# Altium schematic sheet MSP430F249.SchDoc
size A
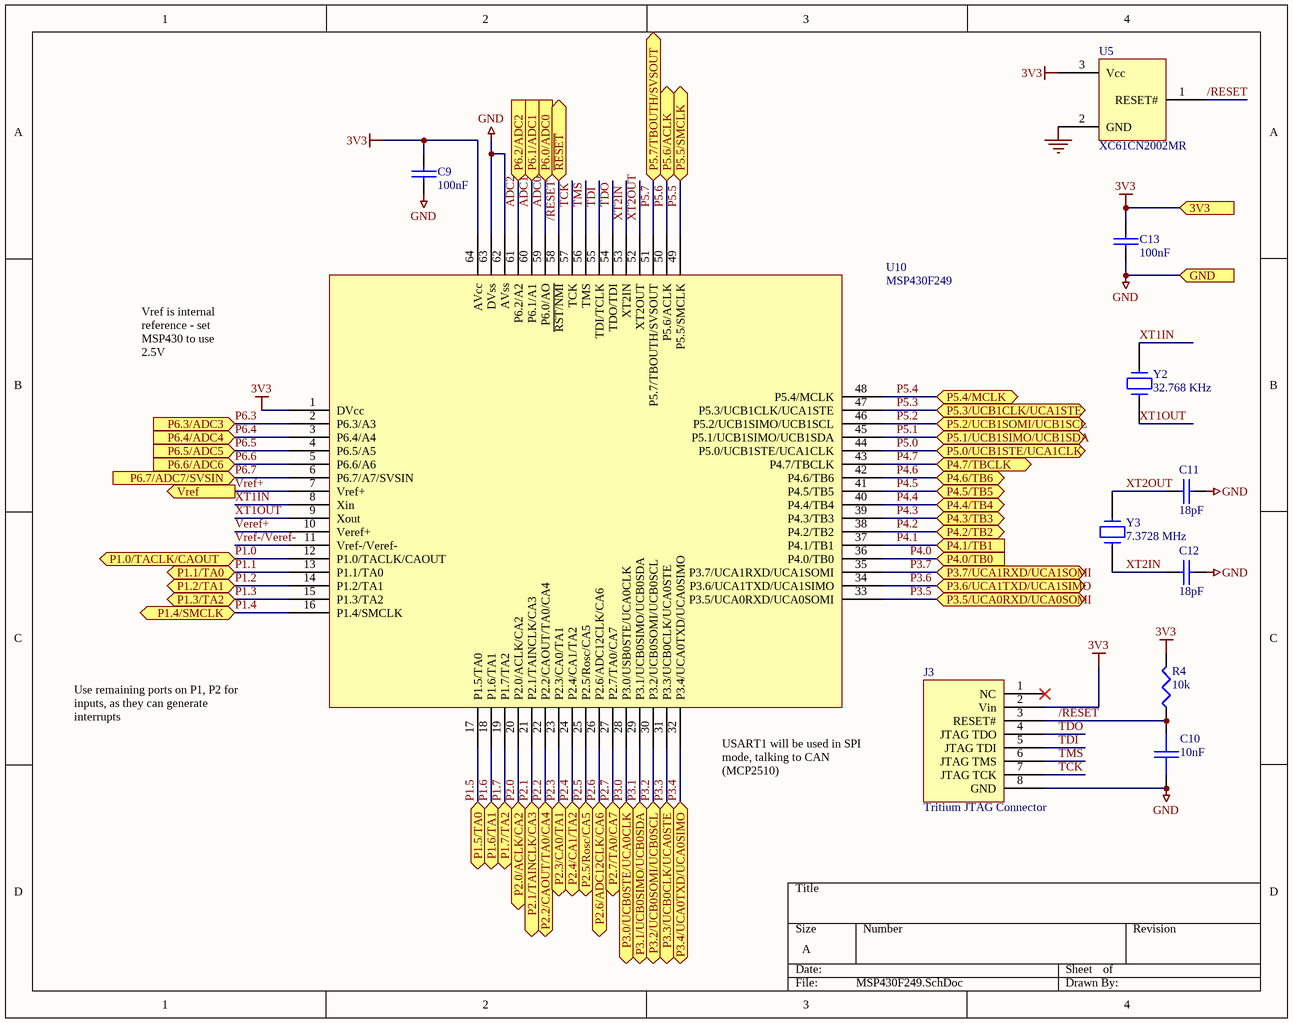
[diagram p0: MSP430F249.SchDoc]

## Parts
C9  100nF  [0603]
C10  10nF  [0603]
C11  18pF  [0603]
C12  18pF  [0603]
C13  100nF  [0603]
J3  Tritium JTAG Connector  [IDC8]
R4  10k  [0603]
U5  XC61CN2002MR  [SOT23-3]
U10  MSP430F249  [QFP64]
Y2  32.768 KHz  [WATCHA]
Y3  7.3728 MHz  [HC49/4H]

## Ports
3V3, GND, P1.0/TACLK/CAOUT, P1.1/TA0, P1.2/TA1, P1.3/TA2, P1.4/SMCLK, P1.5/TA0, P1.6/TA1, P1.7/TA2, P2.0/ACLK/CA2, P2.1/TAINCLK/CA3, P2.2/CAOUT/TA0/CA4, P2.3/CA0/TA1, P2.4/CA1/TA2, P2.5/Rosc/CA5, P2.6/ADC12CLK/CA6, P2.7/TA0/CA7, P3.0/UCB0STE/UCA0CLK, P3.1/UCB0SIMO/UCB0SDA, P3.2/UCB0SOMI/UCB0SCL, P3.3/UCB0CLK/UCA0STE, P3.4/UCA0TXD/UCA0SIMO, P3.5/UCA0RXD/UCA0SOMI, P3.6/UCA1TXD/UCA1SIMO, P3.7/UCA1RXD/UCA1SOMI, P4.0/TB0 (in), P4.1/TB1 (in), P4.2/TB2, P4.3/TB3, P4.4/TB4, P4.5/TB5, P4.6/TB6, P4.7/TBCLK, P5.0/UCB1STE/UCA1CLK, P5.1/UCB1SIMO/UCB1SDA, P5.2/UCB1SOMI/UCB1SCL, P5.3/UCB1CLK/UCA1STE, P5.4/MCLK, P5.5/SMCLK, P5.6/ACLK, P5.7/TBOUTH/SVSOUT, P6.0/ADC0 (in), P6.1/ADC1 (in), P6.2/ADC2 (in), P6.3/ADC3 (in), P6.4/ADC4 (in), P6.5/ADC5 (in), P6.6/ADC6 (in), P6.7/ADC7/SVSIN (in), Vref (out), ~{RESET}

## Nets
3V3: C9.1 C13.1 J3.2(Vin) R4.2 U5.3(Vcc) U10.1(DVcc) U10.64(AVcc) ; port 3V3
GND: C9.2 C10.2 C11.2 C12.2 C13.2 J3.8(GND) U5.2(GND) U10.62(AVss) U10.63(DVss) ; port GND
/RESET: C10.1 J3.3(RESET#) R4.1 U5.1(RESET#) U10.58(~{RST/NMI}) ; port ~{RESET}
ADC0: U10.59(P6.0/AO) ; port P6.0/ADC0
ADC1: U10.60(P6.1/A1) ; port P6.1/ADC1
ADC2: U10.61(P6.2/A2) ; port P6.2/ADC2
P1.0: U10.12(P1.0/TACLK/CAOUT) ; port P1.0/TACLK/CAOUT
P1.1: U10.13(P1.1/TA0) ; port P1.1/TA0
P1.2: U10.14(P1.2/TA1) ; port P1.2/TA1
P1.3: U10.15(P1.3/TA2) ; port P1.3/TA2
P1.4: U10.16(P1.4/SMCLK) ; port P1.4/SMCLK
P1.5: U10.17(P1.5/TA0) ; port P1.5/TA0
P1.6: U10.18(P1.6/TA1) ; port P1.6/TA1
P1.7: U10.19(P1.7/TA2) ; port P1.7/TA2
P2.0: U10.20(P2.0/ACLK/CA2) ; port P2.0/ACLK/CA2
P2.1: U10.21(P2.1/TAINCLK/CA3) ; port P2.1/TAINCLK/CA3
P2.2: U10.22(P2.2/CAOUT/TA0/CA4) ; port P2.2/CAOUT/TA0/CA4
P2.3: U10.23(P2.3/CA0/TA1) ; port P2.3/CA0/TA1
P2.4: U10.24(P2.4/CA1/TA2) ; port P2.4/CA1/TA2
P2.5: U10.25(P2.5/Rosc/CA5) ; port P2.5/Rosc/CA5
P2.6: U10.26(P2.6/ADC12CLK/CA6) ; port P2.6/ADC12CLK/CA6
P2.7: U10.27(P2.7/TA0/CA7) ; port P2.7/TA0/CA7
P3.0: U10.28(P3.0/USB0STE/UCA0CLK) ; port P3.0/UCB0STE/UCA0CLK
P3.1: U10.29(P3.1/UCB0SIMO/UCB0SDA) ; port P3.1/UCB0SIMO/UCB0SDA
P3.2: U10.30(P3.2/UCB0SOMI/UCB0SCL) ; port P3.2/UCB0SOMI/UCB0SCL
P3.3: U10.31(P3.3/UCB0CLK/UCA0STE) ; port P3.3/UCB0CLK/UCA0STE
P3.4: U10.32(P3.4/UCA0TXD/UCA0SIMO) ; port P3.4/UCA0TXD/UCA0SIMO
P3.5: U10.33(P3.5/UCA0RXD/UCA0SOMI) ; port P3.5/UCA0RXD/UCA0SOMI
P3.6: U10.34(P3.6/UCA1TXD/UCA1SIMO) ; port P3.6/UCA1TXD/UCA1SIMO
P3.7: U10.35(P3.7/UCA1RXD/UCA1SOMI) ; port P3.7/UCA1RXD/UCA1SOMI
P4.0: U10.36(P4.0/TB0) ; port P4.0/TB0
P4.1: U10.37(P4.1/TB1) ; port P4.1/TB1
P4.2: U10.38(P4.2/TB2) ; port P4.2/TB2
P4.3: U10.39(P4.3/TB3) ; port P4.3/TB3
P4.4: U10.40(P4.4/TB4) ; port P4.4/TB4
P4.5: U10.41(P4.5/TB5) ; port P4.5/TB5
P4.6: U10.42(P4.6/TB6) ; port P4.6/TB6
P4.7: U10.43(P4.7/TBCLK) ; port P4.7/TBCLK
P5.0: U10.44(P5.0/UCB1STE/UCA1CLK) ; port P5.0/UCB1STE/UCA1CLK
P5.1: U10.45(P5.1/UCB1SIMO/UCB1SDA) ; port P5.1/UCB1SIMO/UCB1SDA
P5.2: U10.46(P5.2/UCB1SIMO/UCB1SCL) ; port P5.2/UCB1SOMI/UCB1SCL
P5.3: U10.47(P5.3/UCB1CLK/UCA1STE) ; port P5.3/UCB1CLK/UCA1STE
P5.4: U10.48(P5.4/MCLK) ; port P5.4/MCLK
P5.5: U10.49(P5.5/SMCLK) ; port P5.5/SMCLK
P5.6: U10.50(P5.6/ACLK) ; port P5.6/ACLK
P5.7: U10.51(P5.7/TBOUTH/SVSOUT) ; port P5.7/TBOUTH/SVSOUT
P6.3: U10.2(P6.3/A3) ; port P6.3/ADC3
P6.4: U10.3(P6.4/A4) ; port P6.4/ADC4
P6.5: U10.4(P6.5/A5) ; port P6.5/ADC5
P6.6: U10.5(P6.6/A6) ; port P6.6/ADC6
P6.7: U10.6(P6.7/A7/SVSIN) ; port P6.7/ADC7/SVSIN
TCK: J3.7(JTAG_TCK) U10.57(TCK)
TDI: J3.5(JTAG_TDI) U10.55(TDI/TCLK)
TDO: J3.4(JTAG_TDO) U10.54(TDO/TDI)
TMS: J3.6(JTAG_TMS) U10.56(TMS)
Veref+: U10.10(Veref+)
Vref+: U10.7(Vref+) ; port Vref
Vref-/Veref-: U10.11(Vref-/Veref-)
XT1IN: U10.8(Xin) Y2.2
XT1OUT: U10.9(Xout) Y2.1
XT2IN: C12.1 U10.53(XT2IN) Y3.1
XT2OUT: C11.1 U10.52(XT2OUT) Y3.2

Not connected (* = marked no-connect by the designer): J3 1(NC)*

## Notes on the sheet
- Vref is internal reference - set MSP430 to use 2.5V
- Use remaining ports on P1, P2 for inputs, as they can generate interrupts
- (near U10) USART1 will be used in SPI mode, talking to CAN (MCP2510)

## Library data of the parts
C9-C13 = CAP: Capacitor
  C9: Element14: 9406140; Price: 0.13
  C11 C12: Element14: 721-992; Element14 Price: 0.11
  C13: Element14: 9406140; Element14 Price: 0.13
J3 = 430F_JTAG_TRITIUM: Tritium JTAG interface for MSP430; Element14 (only one required for entire board): 3418558 (20 way); Element14 Price (only one required for entire board): 1.10
R4 = RES1: Resistor
U5 = XC61F: SOT23 reset generator; Element14: 3605486; Element14 Price: 1.74
Y2 Y3 = CRYSTAL
  Y2: Element14: 9509682; Element14 Price: 2.65
  Y3: Element14: 9713719; Element14 Price: 2.85
U10 = MSP430F249: Element14 (low stock): 1649448; Element14 Price: 15.96; Digikey: 296-23084-1-ND; Digikey Price: 11.53